# Altium schematic sheet Regulate load.SchDoc
size A3; SheetNumber: 4; SheetTotal: 7
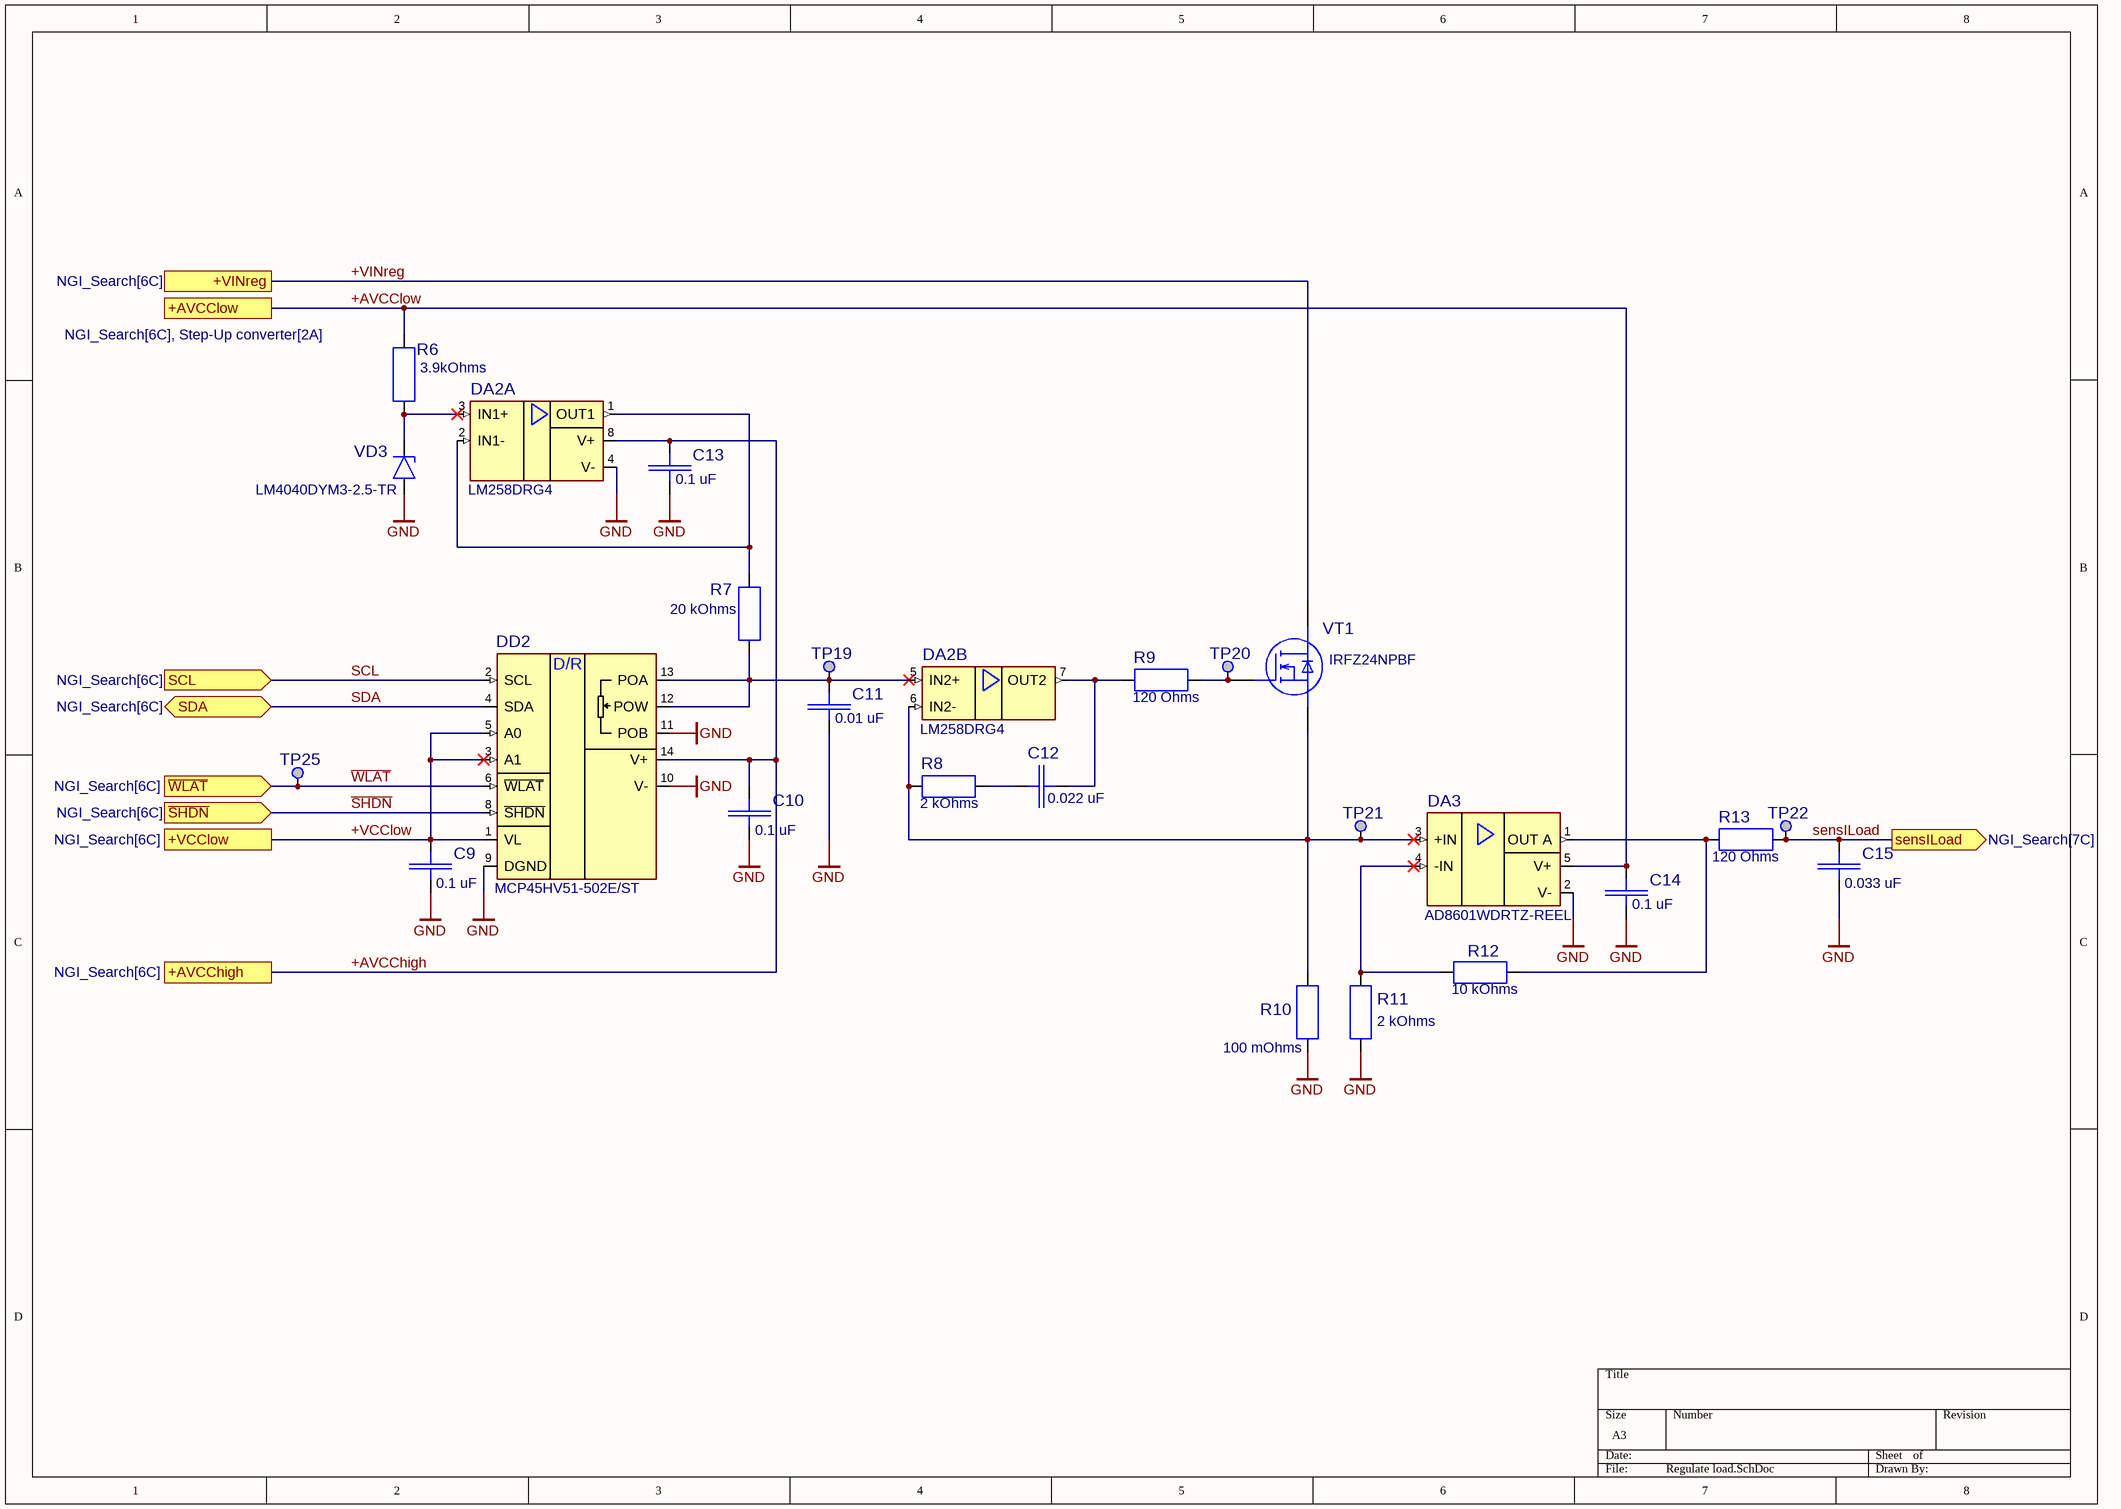
[diagram p0: Regulate load.SchDoc]

## Parts
C9  value 0.1 uF  [Capacitor0805_THICKNESS0.8]  (hidden comment: CL21B104KBCNNWC)
C10  value 0.1 uF  [Capacitor0805_THICKNESS0.8]  (hidden comment: CL21B104KBCNNWC)
C11  value 0.01 uF  [Capacitor0805_THICKNESS0.8]  (hidden comment: CL21B103KBANNNL)
C12  value 0.022 uF  [Capacitor0805_THICKNESS0.8]  (hidden comment: CL21B223KBANNND)
C13  value 0.1 uF  [Capacitor0805_THICKNESS0.8]  (hidden comment: CL21B104KBCNNWC)
C14  value 0.1 uF  [Capacitor0805_THICKNESS0.8]  (hidden comment: CL21B104KBCNNWC)
C15  value 0.033 uF  [Capacitor0805_THICKNESS0.8]  (hidden comment: C0805C333K5RAC)
DA2  LM258DRG4  [SOIC-8]  (parts A,B of 2)
DA3  AD8601WDRTZ-REEL  [SOT-23 5pin]
DD2  MCP45HV51-502E/ST  [TSOP-14]
R6  value 3.9kOhms  [Resistor0805_THICKNESS0.6]  (hidden comment: RC0805FR-103K9L)
R7  value 20 kOhms  [Resistor0805_THICKNESS0.6]  (hidden comment: RC0805FR-1020KL)
R8  value 2 kOhms  [Resistor0805_THICKNESS0.6]  (hidden comment: RC0805FR-072KL)
R9  value 120 Ohms  [Resistor0805_THICKNESS0.6]  (hidden comment: RC0805FR-07120RL)
R10  value 100 mOhms  [Resistor2512_THICKNESS_0.9]  (hidden comment: CRA2512-FZ-R100ELF)
R11  value 2 kOhms  [Resistor0805_THICKNESS0.6]  (hidden comment: RC0805FR-072KL)
R12  value 10 kOhms  [Resistor0805_THICKNESS0.6]  (hidden comment: RC0805FR-0710KL)
R13  value 120 Ohms  [Resistor0805_THICKNESS0.6]  (hidden comment: RC0805FR-07120RL)
TP19  test point  [test point]  (value not drawn)
TP20  test point  [test point]  (value not drawn)
TP21  test point  [test point]  (value not drawn)
TP22  test point  [test point]  (value not drawn)
TP25  test point  [test point]  (value not drawn)
VD3  LM4040DYM3-2.5-TR  [SOT23 3pin]
VT1  IRFZ24NPBF  [IRFZ24NPBF TO-220 with HS FA-T220-64E]

## Ports
+AVCChigh (see NGI_Search[6C]), +AVCClow (see NGI_Search[6C], Step-Up converter[2A]), +VCClow (see NGI_Search[6C]), +VINreg (see NGI_Search[6C]), SCL (in, see NGI_Search[6C]), SDA (bidir, see NGI_Search[6C]), sensILoad (out, see NGI_Search[7C]), ~{SHDN} (in, see NGI_Search[6C]), ~{WLAT} (in, see NGI_Search[6C])

## Nets
GND: C9.1 C10.1 C11.1 C13.1 C14.1 C15.1 DA2.4(V-) DA3.2(V-) DD2.9(DGND) DD2.10(V-) DD2.11(POB) R10.1 R11.2 VD3.1(+)
+AVCChigh: C10.2 C13.2 DA2.8(V+) DD2.14(V+) ; port +AVCChigh
+AVCClow: C14.2 DA3.5(V+) R6.2 ; port +AVCClow
+VCClow: C9.2 DD2.1(VL) DD2.3(A1) DD2.5(A0) ; port +VCClow
+VINreg: VT1.2(D) ; port +VINreg
~{SHDN}: DD2.8(~{SHDN}) ; port ~{SHDN}
SCL: DD2.2(SCL) ; port SCL
SDA: DD2.4(SDA) ; port SDA
sensILoad: C15.2 R13.2 TP22.1 ; port sensILoad
~{WLAT}: DD2.6(~{WLAT}) TP25.1 ; port ~{WLAT}
NetC11_2: C11.2 DA2.5(IN2+) DD2.12(POW) DD2.13(POA) R7.1 TP19.1
NetC12_1: C12.1 R8.2
NetC12_2: C12.2 DA2.7(OUT2) R9.1
NetDA2_1: DA2.1(OUT1) DA2.2(IN1-) R7.2
NetDA2_3: DA2.3(IN1+) R6.1 VD3.2(-)
NetDA2_6: DA2.6(IN2-) DA3.3(+IN) R8.1 R10.2 TP21.1 VT1.3(S)
NetDA3_1: DA3.1(OUT_A) R12.2 R13.1
NetDA3_4: DA3.4(-IN) R11.1 R12.1
NetR9_2: R9.2 TP20.1 VT1.1(G)

Not connected (* = marked no-connect by the designer): DD2 7(NC); VD3 3(NC)

## Notes on the sheet
- (in symbol MCP45HV51-502E/ST) D/R

## Library data of the parts
C9 C10 C13 C14 = CL21B104KBCNNWC: Multilayer Ceramic Capacitors MLCC - SMD/SMT 100nF+/-10% 50V X7R 0805; Manufacturer: Samsung Electro-Mechanics; Tolerance: 10%; Dielectric: X7R; ManufacturerPartNumber: CL21B104KBCNNWC; Mouser Price/Stock: https://eu.mouser.com/ProductDetail/Samsung-Electro-Mechanics/CL21B104KBCNNWC?qs=yOVawPpwOwlu2UTVxWhmlw%3D%3D; Power/Voltage: 50V; Case: 0805; Datasheet Link: https://eu.mouser.com/datasheet/2/585/MLCC-1837944.pdf; Mouser Part Number: 187-CL21B104KBCNNWC
C11 = CL21B103KBANNNL: Multilayer Ceramic Capacitors MLCC - SMD/SMT 10nF+/-10% 50V X7R 2 0805; Manufacturer: Samsung Electro-Mechanics; Tolerance: 10%; Case: 0805; Datasheet Link: https://eu.mouser.com/datasheet/2/585/MLCC-1837944.pdf; Dielectric: X7R; ManufacturerPartNumber: CL21B103KBANNNL; Mouser Part Number: 187-CL21B103KBANNNL; Mouser Price/Stock: https://eu.mouser.com/ProductDetail/Samsung-Electro-Mechanics/CL21B103KBANNNL?qs=sGAEpiMZZMvsSlwiRhF8qtsGU%2FCnaNeQUbGZYi74bLm5gwqVLR8V4A%3D%3D; Power/Voltage: 50V
C12 = CL21B223KBANNND: Multilayer Ceramic Capacitors MLCC - SMD/SMT 22nF+/-10% 50V X7R 2 0805; Manufacturer: Samsung Electro-Mechanics; Tolerance: 10%; Case: 0805; Datasheet Link: https://eu.mouser.com/datasheet/2/585/MLCC-1837944.pdf; Dielectric: X7R; ManufacturerPartNumber: CL21B223KBANNND; Mouser Part Number: 187-CL21B223KBANNND; Mouser Price/Stock: https://eu.mouser.com/ProductDetail/Samsung-Electro-Mechanics/CL21B223KBANNND?qs=sGAEpiMZZMvsSlwiRhF8qlxW52pIu5FNS13PGP1GZqY%3D; Power/Voltage: 50V
C15 = C0805C333K5RAC: Multilayer Ceramic Capacitors MLCC - SMD/SMT 50V 0.033uF X7R 0805 10%; Manufacturer: KEMET; Case: 0805; Datasheet Link: https://eu.mouser.com/datasheet/2/447/KEM_C1002_X7R_SMD-3316098.pdf; Dielectric: X7R; ManufacturerPartNumber: C0805C333K5RAC; Mouser Part Number: 80-C0805C333K5RAC; Mouser Price/Stock: https://eu.mouser.com/ProductDetail/KEMET/C0805C333K5RAC?qs=sGAEpiMZZMvsSlwiRhF8qtpM02mjhsWZUP8GnSbnH5w%3D; Power/Voltage: 50V; Tolerance: 10%
DA2 = LM258DRG4: Operational Amplifiers - Op Amps Dual Operational Amplifier; Manufacturer: Texas Instruments; Case: SOIC-8; Datasheet Link: https://www.ti.com/lit/ds/symlink/lm2904ba.pdf?ts=1704458867193&ref_url=https%253A%252F%252Fwww.mouser.com.tr%252F; ManufacturerPartNumber: LM258DRG4; Mouser Price/Stock: https://eu.mouser.com/ProductDetail/Texas-Instruments/LM258DRG4?qs=VBduBm9rCJSSuHFL4rPBDA%3D%3D; Mouser Part Number: 595-LM258DRG4
DA3 = AD8601WDRTZ-REEL: Precision Amplifiers Single, Lw Cst, 8MHz, RRIO, 5V OpAmp; Manufacturer: Analog Devices Inc.; Case: SOT-23 5pin; Datasheet Link: https://eu.mouser.com/datasheet/2/609/ad8601_8602_8604-3119459.pdf; ManufacturerPartNumber: AD8601WDRTZ-REEL; Mouser Part Number: 584-AD8601WDRTZ-R; Mouser Price/Stock: https://eu.mouser.com/ProductDetail/Analog-Devices/AD8601WDRTZ-REEL?qs=%2FtpEQrCGXCxTn38zRtQA5Q%3D%3D
DD2 = MCP45HV51-502E/ST: Digital Potentiometer ICs 8-bit, vol Digi Pot 5K ohm, 14ld TSSOP; Manufacturer: Microchip; ManufacturerPartNumber: MCP45HV51-502E/ST; Mouser Price/Stock: https://eu.mouser.com/ProductDetail/Microchip-Technology/MCP45HV51-502E-ST?qs=wzzOUr4NhYo51RHFtIUWQw%3D%3D; Case: TSSOP-14; Datasheet Link: https://eu.mouser.com/datasheet/2/268/MCP45HVX1_Data_Sheet_DS20005304-3224813.pdf; Mouser Part Number: 579-MCP45HV51-502EST
R6 = RC0805FR-103K9L: Thick Film Resistors 3.9kOhms 1/8W 0805 1%; Manufacturer: YAGEO; Power/Voltage: 125 mW / 150V; Case: 0805; Datasheet Link: https://eu.mouser.com/datasheet/2/447/PYu_RC_Group_51_RoHS_L_11-1984063.pdf; ManufacturerPartNumber: RC0805FR-103K9L; Mouser Part Number: 603-RC0805FR-103K9L; Mouser Price/Stock: https://eu.mouser.com/ProductDetail/YAGEO/RC0805FR-103K9L?qs=sGAEpiMZZMvdGkrng054t8AJgcdMkx7xNu5h6kkjzWs%3D; Tolerance: 1%
R7 = RC0805FR-1020KL: Thick Film Resistors 20 kOhms 125 mW 0805 1%; Manufacturer: YAGEO; Power/Voltage: 125 mW / 150V; Case: 0805; Datasheet Link: https://eu.mouser.com/datasheet/2/447/PYu_RC_Group_51_RoHS_L_11-1984063.pdf; ManufacturerPartNumber: RC0805FR-1020KL; Mouser Part Number: 603-RC0805FR-1020KL; Mouser Price/Stock: https://eu.mouser.com/ProductDetail/YAGEO/RC0805FR-1020KL?qs=sGAEpiMZZMvdGkrng054t7z4BkURc4LzyQBLWrMO%252BznK%2FJbWTd%2FqOQ%3D%3D; Tolerance: 1%
R8 R11 = RC0805FR-072KL: Thick Film Resistors 2 kOhms 125 mW 0805 1%; Manufacturer: YAGEO; Power/Voltage: 125 mW / 150V; Case: 0805; Datasheet Link: https://eu.mouser.com/datasheet/2/447/YAGEO_PYu_RC_Group_51_RoHS_L_12-3313492.pdf; ManufacturerPartNumber: RC0805FR-072KL; Mouser Part Number: 603-RC0805FR-072KL; Mouser Price/Stock: https://eu.mouser.com/ProductDetail/YAGEO/RC0805FR-072KL?qs=sGAEpiMZZMvdGkrng054t8Tx25L%252BvTaRvd4yrUANrI8%3D; Tolerance: 1%
R9 R13 = RC0805FR-07120RL: Thick Film Resistors 120 Ohms 125 mW 0805 1%; Manufacturer: YAGEO; Power/Voltage: 125 mW / 150V; ManufacturerPartNumber: RC0805FR-07120RL; Tolerance: 1%; Case: 0805; Mouser Price/Stock: https://eu.mouser.com/ProductDetail/YAGEO/RC0805FR-07120RL?qs=sGAEpiMZZMvdGkrng054t8Tx25L%252BvTaRzcdZIgz1A9Y%3D; Datasheet Link: https://eu.mouser.com/datasheet/2/447/YAGEO_PYu_RC_Group_51_RoHS_L_12-3313492.pdf; Mouser Part Number: 603-RC0805FR-07120RL
R10 = CRA2512-FZ-R100ELF: Current Sense Resistors 0.100ohms 1% +/- 50PPM; Manufacturer: Bourns; Power/Voltage: 3 W; Case: 2512; Datasheet Link: https://eu.mouser.com/datasheet/2/54/cra-1862173.pdf; ManufacturerPartNumber: CRA2512-FZ-R100ELF; Mouser Part Number: 652-CRA2512FZR100ELF; Mouser Price/Stock: https://eu.mouser.com/ProductDetail/Bourns/CRA2512-FZ-R100ELF?qs=sGAEpiMZZMvdGkrng054t219Tlw6YGVDJEjBibzyJuk%3D; Tolerance: 1%
R12 = RC0805FR-0710KL: Thick Film Resistors 10 kOhms 125 mW 0805 1%; Manufacturer: YAGEO; Power/Voltage: 125 mW / 150V; Case: 0805; Datasheet Link: https://eu.mouser.com/datasheet/2/447/YAGEO_PYu_RC_Group_51_RoHS_L_12-3313492.pdf; ManufacturerPartNumber: RC0805FR-0710KL; Mouser Part Number: 603-RC0805FR-0710KL; Mouser Price/Stock: https://eu.mouser.com/ProductDetail/YAGEO/RC0805FR-0710KL?qs=sGAEpiMZZMvdGkrng054txdMlaQGj9fi4uZGpN02qIo%3D; Tolerance: 1%
VD3 = LM4040DYM3-2.5-TR: Voltage References Shunt Voltage Reference, 2.5V, 1.0% Accuracy, 150ppm/deg; Manufacturer: Microchip; Case: SOT-23 3pin; Datasheet Link: https://eu.mouser.com/datasheet/2/268/LM4040_41_Precision_Micropower_Shunt_Voltage_Refer-1890894.pdf; ManufacturerPartNumber: LM4040DYM3-2.5-TR; Mouser Part Number: 998-LM4040DYM3-2.5TR; Mouser Price/Stock: https://eu.mouser.com/ProductDetail/Microchip-Technology/LM4040DYM3-2.5-TR?qs=Y3Q3JoKAO1S64N4CecjyLw%3D%3D
VT1 = IRFZ24NPBF: MOSFT 55V 17A 70mOhm 13.3nC; Manufacturer: Infineon; Case: TO-220; Datasheet Link: https://eu.mouser.com/datasheet/2/196/Infineon_IRFZ24N_DataSheet_v01_01_EN-3363353.pdf; ManufacturerPartNumber: IRFZ24NPBF; Mouser Part Number: 942-IRFZ24NPBF; Mouser Price/Stock: https://eu.mouser.com/ProductDetail/Infineon-Technologies/IRFZ24NPBF?qs=9%252BKlkBgLFf0TQgSTtY4J0g%3D%3D